# Altium project Inverter Driver Board.PrjPcb
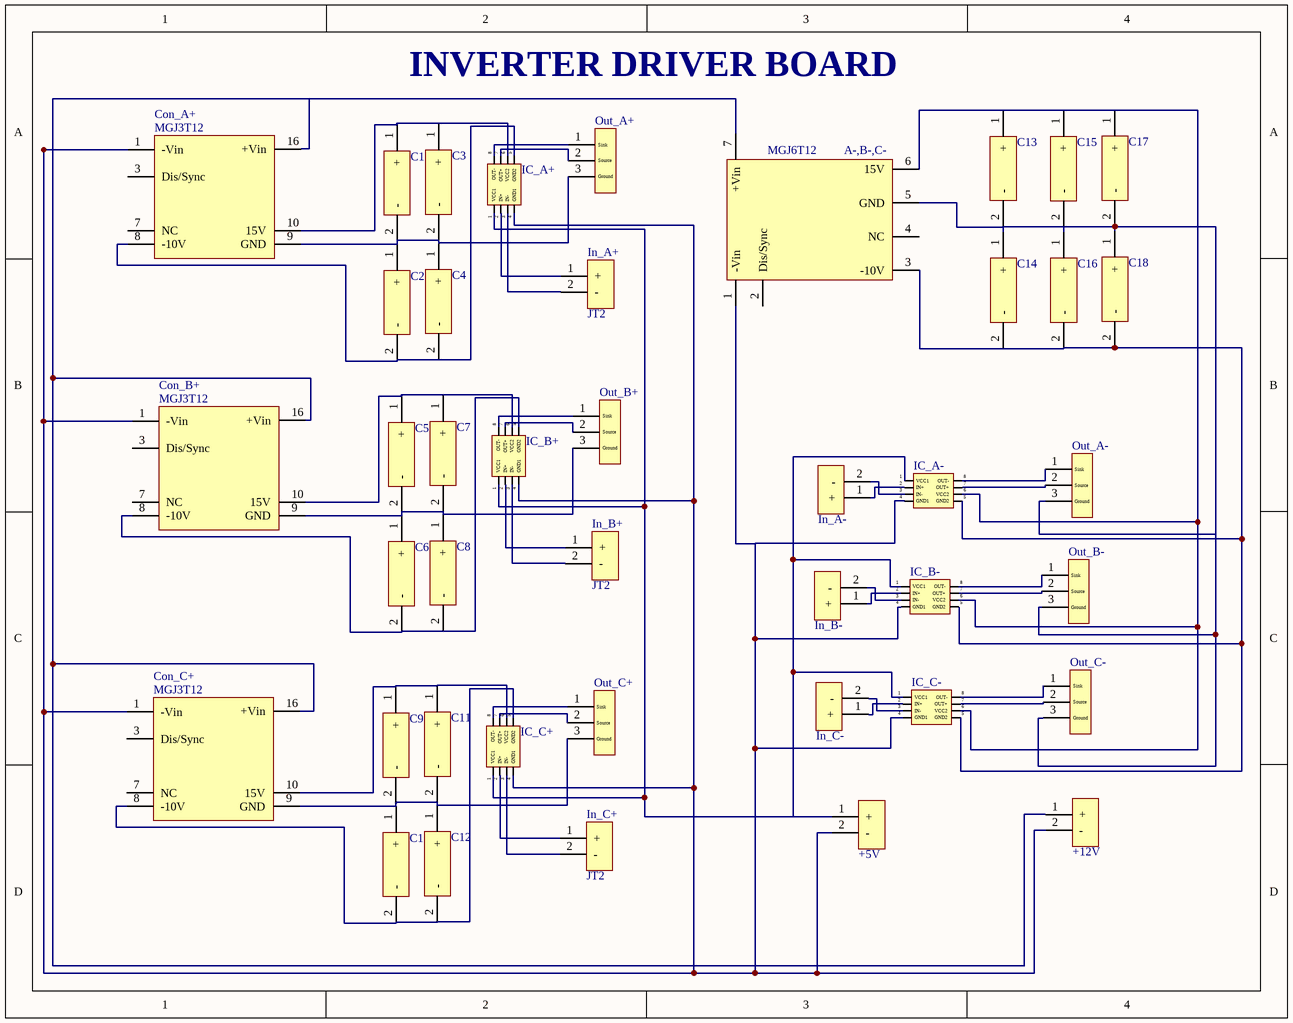
[diagram p0: Inverter Driver Board.SchDoc]
1 sheet, 42 parts. Net scope: global (net labels, ports and power ports of the same name join across sheets).
Board files: Inverter Driver Board.PcbDoc, Inverter Driver Board (By Auto Routing).PcbDoc

## Sheet Inverter Driver Board.SchDoc
size A; SheetNumber: 1; SheetTotal: 1

### Parts
+5V  JT2  [PCBComponent_1]  (value not drawn)
+12V  JT2  [PCBComponent_1]  (value not drawn)
A-,B-,C-  MGJ6T12  [MGJ6T12]  (value not drawn)
C1  Cap  [Cap]  (value not drawn)
C2  Cap  [Cap]  (value not drawn)
C3  Cap  [Cap]  (value not drawn)
C4  Cap  [Cap]  (value not drawn)
C5  Cap  [Cap]  (value not drawn)
C6  Cap  [Cap]  (value not drawn)
C7  Cap  [Cap]  (value not drawn)
C8  Cap  [Cap]  (value not drawn)
C9  Cap  [Cap]  (value not drawn)
C10  Cap  [Cap]  (value not drawn)
C11  Cap  [Cap]  (value not drawn)
C12  Cap  [Cap]  (value not drawn)
C13  Cap  [Cap]  (value not drawn)
C14  Cap  [Cap]  (value not drawn)
C15  Cap  [Cap]  (value not drawn)
C16  Cap  [Cap]  (value not drawn)
C17  Cap  [Cap]  (value not drawn)
C18  Cap  [Cap]  (value not drawn)
Con_A+  Component_1  [PCBComponent_1]  (value not drawn)
Con_B+  Component_1  [PCBComponent_1]  (value not drawn)
Con_C+  Component_1  [PCBComponent_1]  (value not drawn)
IC_A+  1EDC60H12AH  [1EDC60H12AH]  (value not drawn)
IC_A-  1EDC60H12AH  [1EDC60H12AH]  (value not drawn)
IC_B+  1EDC60H12AH  [1EDC60H12AH]  (value not drawn)
IC_B-  1EDC60H12AH  [1EDC60H12AH]  (value not drawn)
IC_C+  1EDC60H12AH  [1EDC60H12AH]  (value not drawn)
IC_C-  1EDC60H12AH  [1EDC60H12AH]  (value not drawn)
In_A+  JT2  [PCBComponent_1]
In_A-  JT2  [PCBComponent_1]  (value not drawn)
In_B+  JT2  [PCBComponent_1]
In_B-  JT2  [PCBComponent_1]  (value not drawn)
In_C+  JT2  [PCBComponent_1]
In_C-  JT2  [PCBComponent_1]  (value not drawn)
Out_A+  JT3  [JT3]  (value not drawn)
Out_A-  JT3  [JT3]  (value not drawn)
Out_B+  JT3  [JT3]  (value not drawn)
Out_B-  JT3  [JT3]  (value not drawn)
Out_C+  JT3  [JT3]  (value not drawn)
Out_C-  JT3  [JT3]  (value not drawn)

### Nets
Net+5V_1: +5V.1(+) IC_A+.1(VCC1) IC_A-.1(VCC1) IC_B+.1(VCC1) IC_B-.1(VCC1) IC_C+.1(VCC1) IC_C-.1(VCC1)
Net+5V_2: +5V.2(-) +12V.2(-) A-,B-,C-.1(-Vin) Con_A+.1(-Vin) Con_B+.1(-Vin) Con_C+.1(-Vin) IC_A+.4(GND1) IC_A-.4(GND1) IC_B+.4(GND1) IC_B-.4(GND1) IC_C+.4(GND1) IC_C-.4(GND1)
Net+12V_1: +12V.1(+) A-,B-,C-.7(+Vin) Con_A+.16(+Vin) Con_B+.16(+Vin) Con_C+.16(+Vin)
NetA-,B-,C-_3: A-,B-,C-.3(-10V) C14.2(-) C16.2(-) C18.2(-) IC_A-.5(GND2) IC_B-.5(GND2) IC_C-.5(GND2)
NetA-,B-,C-_5: A-,B-,C-.5(GND) C13.2(-) C14.1(+) C15.2(-) C16.1(+) C17.2(-) C18.1(+) Out_A-.3(Ground) Out_B-.3(Ground) Out_C-.3(Ground)
NetA-,B-,C-_6: A-,B-,C-.6(15V) C13.1(+) C15.1(+) C17.1(+) IC_A-.6(VCC2) IC_B-.6(VCC2) IC_C-.6(VCC2)
NetC1_1: C1.1(+) C3.1(+) Con_A+.10(15V) IC_A+.6(VCC2)
NetC1_2: C1.2(-) C2.1(+) C3.2(-) C4.1(+) Con_A+.9(GND) Out_A+.3(Ground)
NetC2_2: C2.2(-) C4.2(-) Con_A+.8(-10V) IC_A+.5(GND2)
NetC5_1: C5.1(+) C7.1(+) Con_B+.10(15V) IC_B+.6(VCC2)
NetC5_2: C5.2(-) C6.1(+) C7.2(-) C8.1(+) Con_B+.9(GND) Out_B+.3(Ground)
NetC6_2: C6.2(-) C8.2(-) Con_B+.8(-10V) IC_B+.5(GND2)
NetC9_1: C9.1(+) C11.1(+) Con_C+.10(15V) IC_C+.6(VCC2)
NetC9_2: C9.2(-) C10.1(+) C11.2(-) C12.1(+) Con_C+.9(GND) Out_C+.3(Ground)
NetC10_2: C10.2(-) C12.2(-) Con_C+.8(-10V) IC_C+.5(GND2)
NetIC_A+_2: IC_A+.2(IN+) In_A+.1(+)
NetIC_A+_3: IC_A+.3(IN-) In_A+.2(-)
NetIC_A+_7: IC_A+.7(OUT+) Out_A+.2(Source)
NetIC_A+_8: IC_A+.8(OUT-) Out_A+.1(Sink)
NetIC_A-_2: IC_A-.2(IN+) In_A-.1(+)
NetIC_A-_3: IC_A-.3(IN-) In_A-.2(-)
NetIC_A-_7: IC_A-.7(OUT+) Out_A-.2(Source)
NetIC_A-_8: IC_A-.8(OUT-) Out_A-.1(Sink)
NetIC_B+_2: IC_B+.2(IN+) In_B+.1(+)
NetIC_B+_3: IC_B+.3(IN-) In_B+.2(-)
NetIC_B+_7: IC_B+.7(OUT+) Out_B+.2(Source)
NetIC_B+_8: IC_B+.8(OUT-) Out_B+.1(Sink)
NetIC_B-_2: IC_B-.2(IN+) In_B-.1(+)
NetIC_B-_3: IC_B-.3(IN-) In_B-.2(-)
NetIC_B-_7: IC_B-.7(OUT+) Out_B-.2(Source)
NetIC_B-_8: IC_B-.8(OUT-) Out_B-.1(Sink)
NetIC_C+_2: IC_C+.2(IN+) In_C+.1(+)
NetIC_C+_3: IC_C+.3(IN-) In_C+.2(-)
NetIC_C+_7: IC_C+.7(OUT+) Out_C+.2(Source)
NetIC_C+_8: IC_C+.8(OUT-) Out_C+.1(Sink)
NetIC_C-_2: IC_C-.2(IN+) In_C-.1(+)
NetIC_C-_3: IC_C-.3(IN-) In_C-.2(-)
NetIC_C-_7: IC_C-.7(OUT+) Out_C-.2(Source)
NetIC_C-_8: IC_C-.8(OUT-) Out_C-.1(Sink)

Not connected (* = marked no-connect by the designer): A-,B-,C- 2(Dis/Sync) 4(NC); Con_A+ 3(Dis/Sync) 7(NC); Con_B+ 3(Dis/Sync) 7(NC); Con_C+ 3(Dis/Sync) 7(NC)

### Notes on the sheet
- INVERTER DRIVER BOARD
- (in symbol Component_1) MGJ3T12